# EAGLE schematic Nextronic-Arduino (EAGLE 7.5.0)
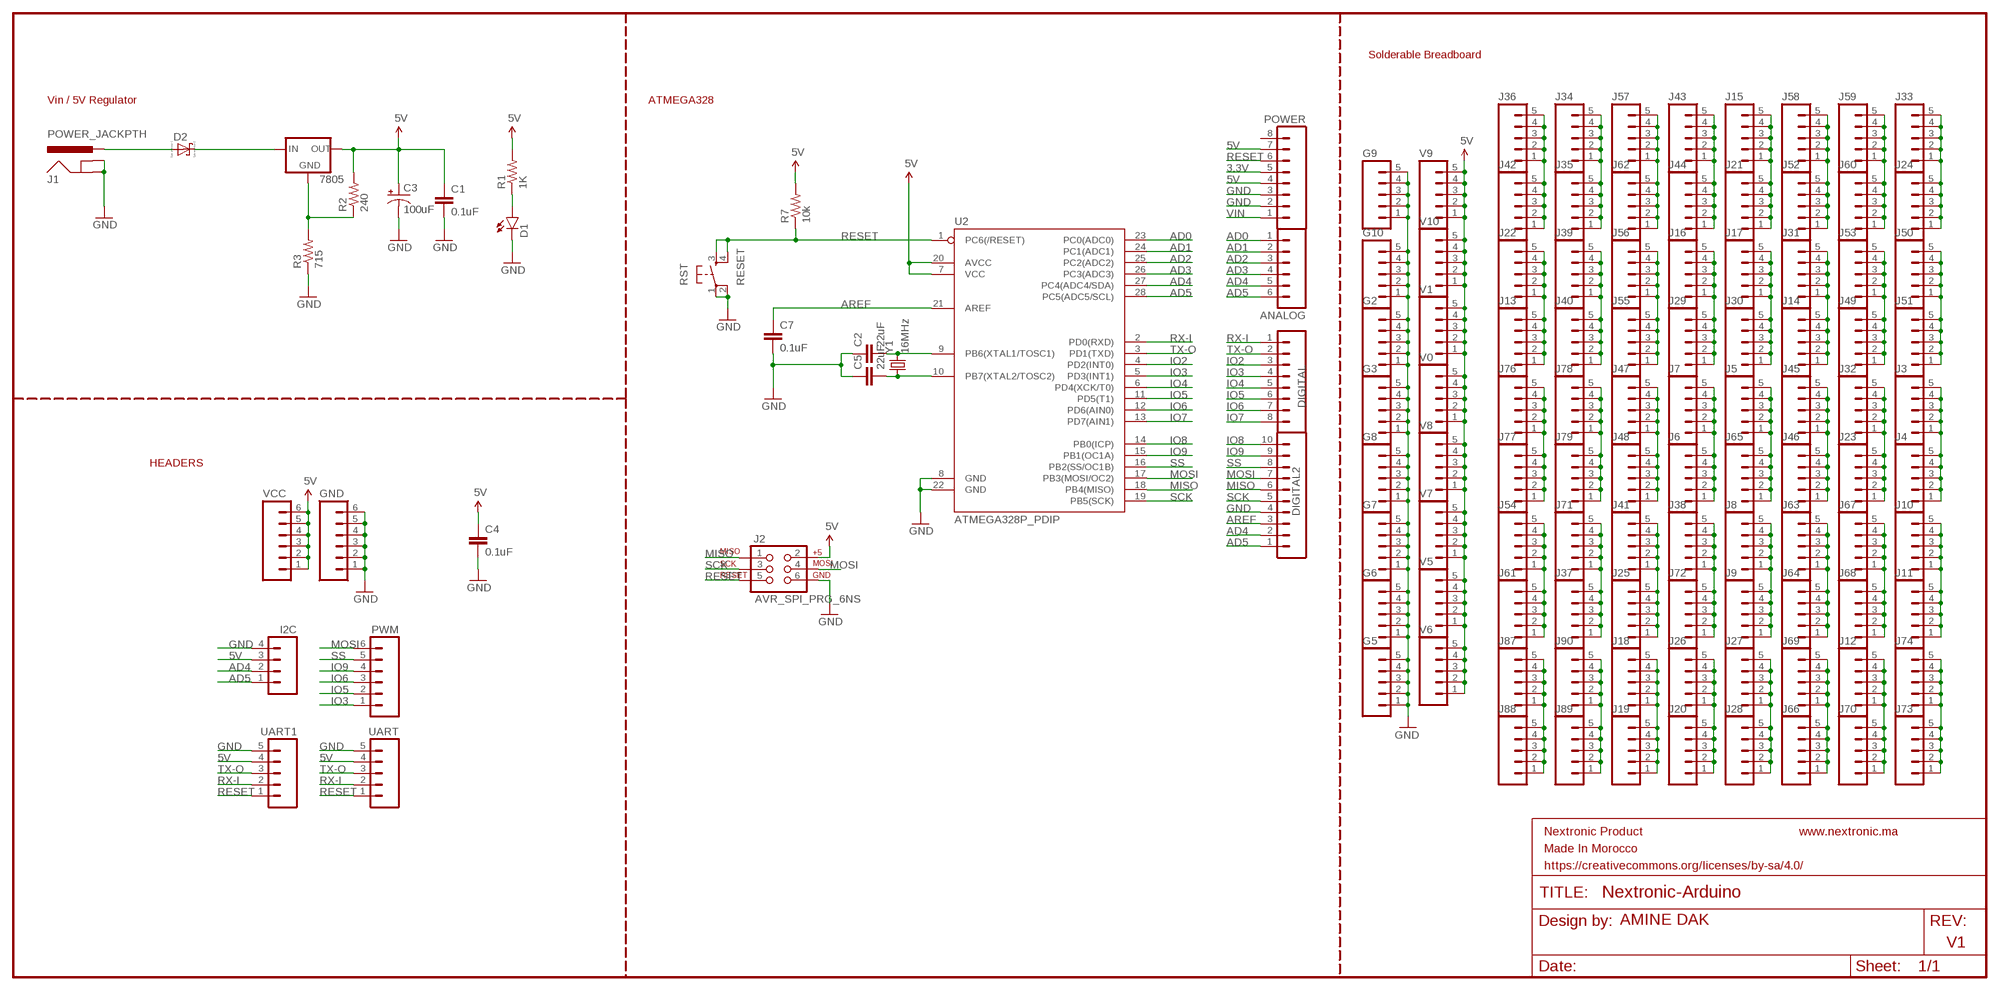
[diagram p0: schematic, sheet 1]

## Parts
7805  V_REG_78XX-TO-220  [TO-220-ALT]
ANALOG  M06SILK_FEMALE_PTH  [1X06]
C1  0.1uF  CAPEZ  [CAP-PTH-SMALLEZ]
C2  22uF  CAPEZ  [CAP-PTH-SMALLEZ]
C3  100uF  CAP_POLPTH1  [CPOL-RADIAL-100UF-25V]
C4  0.1uF  CAPEZ  [CAP-PTH-SMALLEZ]
C5  22uF  CAPEZ  [CAP-PTH-SMALLEZ]
C7  0.1uF  CAPEZ  [CAP-PTH-SMALLEZ]
D1  LED-3MM-NO_SILK  [LED3MM-NS]
D2  SCHOTTKY-DIODEDO35-7  [DIODE_DO35-7]
DIGITAL  M08SILK_FEMALE_PTH  [1X08]
DIGITAL2  M10SILK_FEMALE_PTH  [1X10]
G2  M05PTH  [1X05]
G3  M05PTH  [1X05]
G5  M05PTH  [1X05]
G6  M05PTH  [1X05]
G7  M05PTH  [1X05]
G8  M05PTH  [1X05]
G9  M05PTH  [1X05]
G10  M05PTH  [1X05]
GND  M06SILK_FEMALE_PTH  [1X06]
I2C  M04PTH  [1X04]
J1  POWER_JACKPTH  [POWER_JACK_PTH]
J2  AVR_SPI_PRG_6NS  [2X3-NS]
J3  M05PTH  [1X05]
J4  M05PTH  [1X05]
J5  M05PTH  [1X05]
J6  M05PTH  [1X05]
J7  M05PTH  [1X05]
J8  M05PTH  [1X05]
J9  M05PTH  [1X05]
J10  M05PTH  [1X05]
J11  M05PTH  [1X05]
J12  M05PTH  [1X05]
J13  M05PTH  [1X05]
J14  M05PTH  [1X05]
J15  M05PTH  [1X05]
J16  M05PTH  [1X05]
J17  M05PTH  [1X05]
J18  M05PTH  [1X05]
J19  M05PTH  [1X05]
J20  M05PTH  [1X05]
J21  M05PTH  [1X05]
J22  M05PTH  [1X05]
J23  M05PTH  [1X05]
J24  M05PTH  [1X05]
J25  M05PTH  [1X05]
J26  M05PTH  [1X05]
J27  M05PTH  [1X05]
J28  M05PTH  [1X05]
J29  M05PTH  [1X05]
J30  M05PTH  [1X05]
J31  M05PTH  [1X05]
J32  M05PTH  [1X05]
J33  M05PTH  [1X05]
J34  M05PTH  [1X05]
J35  M05PTH  [1X05]
J36  M05PTH  [1X05]
J37  M05PTH  [1X05]
J38  M05PTH  [1X05]
J39  M05PTH  [1X05]
J40  M05PTH  [1X05]
J41  M05PTH  [1X05]
J42  M05PTH  [1X05]
J43  M05PTH  [1X05]
J44  M05PTH  [1X05]
J45  M05PTH  [1X05]
J46  M05PTH  [1X05]
J47  M05PTH  [1X05]
J48  M05PTH  [1X05]
J49  M05PTH  [1X05]
J50  M05PTH  [1X05]
J51  M05PTH  [1X05]
J52  M05PTH  [1X05]
J53  M05PTH  [1X05]
J54  M05PTH  [1X05]
J55  M05PTH  [1X05]
J56  M05PTH  [1X05]
J57  M05PTH  [1X05]
J58  M05PTH  [1X05]
J59  M05PTH  [1X05]
J60  M05PTH  [1X05]
J61  M05PTH  [1X05]
J62  M05PTH  [1X05]
J63  M05PTH  [1X05]
J64  M05PTH  [1X05]
J65  M05PTH  [1X05]
J66  M05PTH  [1X05]
J67  M05PTH  [1X05]
J68  M05PTH  [1X05]
J69  M05PTH  [1X05]
J70  M05PTH  [1X05]
J71  M05PTH  [1X05]
J72  M05PTH  [1X05]
J73  M05PTH  [1X05]
J74  M05PTH  [1X05]
J76  M05PTH  [1X05]
J77  M05PTH  [1X05]
J78  M05PTH  [1X05]
J79  M05PTH  [1X05]
J87  M05PTH  [1X05]
J88  M05PTH  [1X05]
J89  M05PTH  [1X05]
J90  M05PTH  [1X05]
POWER  M08SILK_FEMALE_PTH  [1X08]
PWM  M06SILK_FEMALE_PTH  [1X06]
R1  1K  RESISTORAXIAL-0.3  [AXIAL-0.3]
R2  240  RESISTORAXIAL-0.3  [AXIAL-0.3]
R3  715  RESISTORAXIAL-0.3  [AXIAL-0.3]
R7  10k  RESISTORAXIAL-0.3  [AXIAL-0.3]
RST  RESET  TAC_SWITCHPTH  [TACTILE-PTH]
U2  ATMEGA328P_PDIP  [DIL28-3]
UART  M05PTH  [1X05]
UART1  M05PTH  [1X05]
V0  M05PTH  [1X05]
V1  M05PTH  [1X05]
V5  M05PTH  [1X05]
V6  M05PTH  [1X05]
V7  M05PTH  [1X05]
V8  M05PTH  [1X05]
V9  M05PTH  [1X05]
V10  M05PTH  [1X05]
VCC  M06SILK_FEMALE_PTH  [1X06]
Y1  16MHz  CRYSTALHC49US  [HC49US]

## Nets
3.3V: POWER.5
5V: 7805.OUT C1.1 C3.1(+) C4.1 I2C.3 J2.2 POWER.4 POWER.7 R1.P$2 R2.P$2 R7.P$2 U2.7(VCC) U2.20(AVCC) UART1.4 UART.4 V0.1 V0.2 V0.3 V0.4 V0.5 V1.1 V1.2 V1.3 V1.4 V1.5 V5.1 V5.2 V5.3 V5.4 V5.5 V6.1 V6.2 V6.3 V6.4 V6.5 V7.1 V7.2 V7.3 V7.4 V7.5 V8.1 V8.2 V8.3 V8.4 V8.5 V9.1 V9.2 V9.3 V9.4 V9.5 V10.1 V10.2 V10.3 V10.4 V10.5 VCC.1 VCC.2 VCC.3 VCC.4 VCC.5 VCC.6
AD0: ANALOG.1 U2.23(PC0(ADC0))
AD1: ANALOG.2 U2.24(PC1(ADC1))
AD2: ANALOG.3 U2.25(PC2(ADC2))
AD3: ANALOG.4 U2.26(PC3(ADC3))
AD4: ANALOG.5 DIGITAL2.2 I2C.2 U2.27(PC4(ADC4/SDA))
AD5: ANALOG.6 DIGITAL2.1 I2C.1 U2.28(PC5(ADC5/SCL))
AREF: C7.1 DIGITAL2.3 U2.21(AREF)
GND: C1.2 C2.1 C3.2(-) C4.2 C5.1 C7.2 D1.K(C) DIGITAL2.4 G2.1 G2.2 G2.3 G2.4 G2.5 G3.1 G3.2 G3.3 G3.4 G3.5 G5.1 G5.2 G5.3 G5.4 G5.5 G6.1 G6.2 G6.3 G6.4 G6.5 G7.1 G7.2 G7.3 G7.4 G7.5 G8.1 G8.2 G8.3 G8.4 G8.5 G9.1 G9.2 G9.3 G9.4 G9.5 G10.1 G10.2 G10.3 G10.4 G10.5 GND.1 GND.2 GND.3 GND.4 GND.5 GND.6 I2C.4 J1.GND J1.GNDBREAK J2.6 POWER.2 POWER.3 R3.P$1 RST.1 RST.2 U2.8(GND) U2.22(GND) UART1.5 UART.5
IO2: DIGITAL.3 U2.4(PD2(INT0))
IO3: DIGITAL.4 PWM.1 U2.5(PD3(INT1))
IO4: DIGITAL.5 U2.6(PD4(XCK/T0))
IO5: DIGITAL.6 PWM.2 U2.11(PD5(T1))
IO6: DIGITAL.7 PWM.3 U2.12(PD6(AIN0))
IO7: DIGITAL.8 U2.13(PD7(AIN1))
IO8: DIGITAL2.10 U2.14(PB0(ICP))
IO9: DIGITAL2.9 PWM.4 U2.15(PB1(OC1A))
MISO: DIGITAL2.6 J2.1 U2.18(PB4(MISO))
MOSI: DIGITAL2.7 J2.4 PWM.6 U2.17(PB3(MOSI/OC2))
N$1: 7805.GND R2.P$1 R3.P$2
N$2: J18.1 J18.2 J18.3 J18.4 J18.5 J19.1 J19.2 J19.3 J19.4 J19.5
N$3: J87.1 J87.2 J87.3 J87.4 J87.5 J88.1 J88.2 J88.3 J88.4 J88.5
N$4: D1.A R1.P$1
N$5: J89.1 J89.2 J89.3 J89.4 J89.5 J90.1 J90.2 J90.3 J90.4 J90.5
N$6: J37.1 J37.2 J37.3 J37.4 J37.5 J71.1 J71.2 J71.3 J71.4 J71.5
N$7: C2.2 U2.9(PB6(XTAL1/TOSC1)) Y1.2
N$8: C5.2 U2.10(PB7(XTAL2/TOSC2)) Y1.1
N$9: J3.1 J3.2 J3.3 J3.4 J3.5 J4.1 J4.2 J4.3 J4.4 J4.5
N$10: J20.1 J20.2 J20.3 J20.4 J20.5 J26.1 J26.2 J26.3 J26.4 J26.5
N$11: J10.1 J10.2 J10.3 J10.4 J10.5 J11.1 J11.2 J11.3 J11.4 J11.5
N$12: J76.1 J76.2 J76.3 J76.4 J76.5 J77.1 J77.2 J77.3 J77.4 J77.5
N$13: J27.1 J27.2 J27.3 J27.4 J27.5 J28.1 J28.2 J28.3 J28.4 J28.5
N$14: J25.1 J25.2 J25.3 J25.4 J25.5 J41.1 J41.2 J41.3 J41.4 J41.5
N$15: J78.1 J78.2 J78.3 J78.4 J78.5 J79.1 J79.2 J79.3 J79.4 J79.5
N$16: J66.1 J66.2 J66.3 J66.4 J66.5 J69.1 J69.2 J69.3 J69.4 J69.5
N$17: J45.1 J45.2 J45.3 J45.4 J45.5 J46.1 J46.2 J46.3 J46.4 J46.5
N$18: D2.A(C) J1.PWR
N$19: J47.1 J47.2 J47.3 J47.4 J47.5 J48.1 J48.2 J48.3 J48.4 J48.5
N$20: J12.1 J12.2 J12.3 J12.4 J12.5 J70.1 J70.2 J70.3 J70.4 J70.5
N$21: J73.1 J73.2 J73.3 J73.4 J73.5 J74.1 J74.2 J74.3 J74.4 J74.5
N$22: J54.1 J54.2 J54.3 J54.4 J54.5 J61.1 J61.2 J61.3 J61.4 J61.5
N$23: J38.1 J38.2 J38.3 J38.4 J38.5 J72.1 J72.2 J72.3 J72.4 J72.5
N$24: J24.1 J24.2 J24.3 J24.4 J24.5 J33.1 J33.2 J33.3 J33.4 J33.5
N$25: J23.1 J23.2 J23.3 J23.4 J23.5 J32.1 J32.2 J32.3 J32.4 J32.5
N$26: J67.1 J67.2 J67.3 J67.4 J67.5 J68.1 J68.2 J68.3 J68.4 J68.5
N$27: J49.1 J49.2 J49.3 J49.4 J49.5 J53.1 J53.2 J53.3 J53.4 J53.5
N$28: J59.1 J59.2 J59.3 J59.4 J59.5 J60.1 J60.2 J60.3 J60.4 J60.5
N$29: J14.1 J14.2 J14.3 J14.4 J14.5 J31.1 J31.2 J31.3 J31.4 J31.5
N$30: J17.1 J17.2 J17.3 J17.4 J17.5 J30.1 J30.2 J30.3 J30.4 J30.5
N$31: J52.1 J52.2 J52.3 J52.4 J52.5 J58.1 J58.2 J58.3 J58.4 J58.5
N$32: J50.1 J50.2 J50.3 J50.4 J50.5 J51.1 J51.2 J51.3 J51.4 J51.5
N$33: J16.1 J16.2 J16.3 J16.4 J16.5 J29.1 J29.2 J29.3 J29.4 J29.5
N$34: J43.1 J43.2 J43.3 J43.4 J43.5 J44.1 J44.2 J44.3 J44.4 J44.5
N$35: J15.1 J15.2 J15.3 J15.4 J15.5 J21.1 J21.2 J21.3 J21.4 J21.5
N$36: J36.1 J36.2 J36.3 J36.4 J36.5 J42.1 J42.2 J42.3 J42.4 J42.5
N$37: J13.1 J13.2 J13.3 J13.4 J13.5 J22.1 J22.2 J22.3 J22.4 J22.5
N$38: J6.1 J6.2 J6.3 J6.4 J6.5 J7.1 J7.2 J7.3 J7.4 J7.5
N$39: J8.1 J8.2 J8.3 J8.4 J8.5 J9.1 J9.2 J9.3 J9.4 J9.5
N$40: J34.1 J34.2 J34.3 J34.4 J34.5 J35.1 J35.2 J35.3 J35.4 J35.5
N$41: J39.1 J39.2 J39.3 J39.4 J39.5 J40.1 J40.2 J40.3 J40.4 J40.5
N$42: J5.1 J5.2 J5.3 J5.4 J5.5 J65.1 J65.2 J65.3 J65.4 J65.5
N$43: J63.1 J63.2 J63.3 J63.4 J63.5 J64.1 J64.2 J64.3 J64.4 J64.5
N$44: J57.1 J57.2 J57.3 J57.4 J57.5 J62.1 J62.2 J62.3 J62.4 J62.5
N$45: J55.1 J55.2 J55.3 J55.4 J55.5 J56.1 J56.2 J56.3 J56.4 J56.5
N$46: 7805.IN D2.C(A)
RESET: J2.5 POWER.6 R7.P$1 RST.3 RST.4 U2.1(PC6(/RESET)) UART1.1 UART.1
RX-I: DIGITAL.1 U2.2(PD0(RXD)) UART1.2 UART.2
SCK: DIGITAL2.5 J2.3 U2.19(PB5(SCK))
SS: DIGITAL2.8 PWM.5 U2.16(PB2(SS/OC1B))
TX-O: DIGITAL.2 U2.3(PD1(TXD)) UART1.3 UART.3
VIN: POWER.1
Unconnected: POWER.8

## Notes on the sheet
- Solderable Breadboard
- Vin / 5V Regulator | ATMEGA328
- HEADERS
- Nextronic Product | www.nextronic.ma
- Made In Morocco
- https://creativecommons.org/licenses/by-sa/4.0/
- TITLE:
- Design by: | AMINE DAK | REV:
- V1
- Date: | Sheet:

## Library data of the parts
7805 = SparkFun-PowerIC:V_REG_78XX: Voltage Regulator Standard 78xx regulator. IGO (Input Ground Output). Spark Fun Electronics SKU : COM-00107; OC_FARNELL: unknown; PROD_ID: VREG-08450; SF_ID: COM-00107
ANALOG GND PWM VCC = SparkFun-Connectors:M06: Header 6 Standard 6-pin 0.1" header. Use with straight break away headers (SKU : PRT-00116), right angle break away headers (PRT-00553), swiss pins (PRT-00743), machine pins (PRT-00117), and female headers (PRT-00115). Molex polarized connector foot print use with SKU : PRT-08094 with associated crimp pins and housings. NOTES ON THE VARIANTS LOCK and LOCK_LONGPADS... This footprint was designed to help hold the alignment of a through-hole component (i.e. 6-pin header) while soldering it into place. You may notice that each hole has been shifted either up or down by 0.005 of an inch from it's more standard position (which is a perfectly straight line). This slight alteration caused the pins (the squares in the middle) to touch the edges of the holes. Because they are alternating, it causes a "brace" to hold the component in place. 0.005 has proven to be the perfect amount of "off-center" position when using our standard breakaway headers. Although looks a little odd when you look at the bare footprint, once you have a header in there, the alteration is very hard to notice. Also,if you push a header all the way into place, it is covered up entirely on the bottom side. This idea of altering the position of holes to aid alignment will be further integrated into the Sparkfun Library for other footprints. It can help hold any component with 3 or more connection pins.; OC_FARNELL: unknown; PROD_ID: CONN-08437
C1 C4 C7 = SparkFun-Capacitors:CAP: Capacitor Standard 0603 ceramic capacitor, and 0.1" leaded capacitor.; MF: MULTICOMP; MPN: MCRR25104X7RK0050; OC_FARNELL: 1216438
C2 C5 = SparkFun-Capacitors:CAP: Capacitor Standard 0603 ceramic capacitor, and 0.1" leaded capacitor.; MF: MULTICOMP; MPN: MCGPR100V226M8X11; OC_FARNELL: 9451579
C3 = SparkFun-Capacitors:CAP_POL: Capacitor Polarized These are standard SMD and PTH capacitors. Normally 10uF, 47uF, and 100uF in electrolytic and tantalum varieties. Always verify the external diameter of the through hole cap, it varies with capacity, voltage, and manufacturer. The EIA devices should be standard.; MF: MULTICOMP; MPN: MCGPR25V107M6.3X11; OC_FARNELL: 9451188
D1 = SparkFun-LED:LED: LEDs Standard schematic elements and footprints for 5mm, 3mm, 1206, and 0603 sized LEDs. 5mm - Spark Fun Electronics SKU : COM-00529 (and others); OC_FARNELL: unknown
D2 = eagle-ltspice:SCHOTTKY-DIODE: Schottky Diode; SPICEMODEL: NONE; SPICEPREFIX: D; SPICETYPE: diode
DIGITAL POWER = SparkFun-Connectors:M08: Header 8 Standard 8-pin 0.1" header. Use with straight break away headers (SKU : PRT-00116), right angle break away headers (PRT-00553), swiss pins (PRT-00743), machine pins (PRT-00117), and female headers (PRT-00115).; OC_FARNELL: unknown; PROD_ID: CONN-08438
DIGITAL2 = SparkFun-Connectors:M10: Header 10 Standard 10-pin 0.1" header. Use with straight break away headers (SKU : PRT-00116), right angle break away headers (PRT-00553), swiss pins (PRT-00743), machine pins (PRT-00117), and female headers (PRT-00115).; OC_FARNELL: unknown; PROD_ID: CONN-11563
G2 G3 G5-G10 J3-J74 J76-J79 J87-J90 UART UART1 V0 V1 V5-V10 = SparkFun-Connectors:M05: Header 5 Standard 5-pin 0.1" header. Use with straight break away headers (SKU : PRT-00116), right angle break away headers (PRT-00553), swiss pins (PRT-00743), machine pins (PRT-00117), and female headers (PRT-00115). Molex polarized connector foot print use with SKU : PRT-08230 with associated crimp pins and housings.; OC_FARNELL: unknown
I2C = SparkFun-Connectors:M04: Header 4 Standard 4-pin 0.1" header. Use with straight break away headers (SKU : PRT-00116), right angle break away headers (PRT-00553), swiss pins (PRT-00743), machine pins (PRT-00117), and female headers (PRT-00115). Molex polarized connector foot print use with SKU : PRT-08231 with associated crimp pins and housings. 1MM SMD Version SKU: PRT-10208; OC_FARNELL: unknown; PROD_ID: CONN-09696
J1 = SparkFun-Connectors:POWER_JACK: Power Jack This is the standard 5.5mm barrel jack for power. The PTH is the most common, proven, reliable, footprint. The Slot footprint only works if the mill layer is transmitted to the PCB fab house so be warned. Mating wall wart : TOL-00298 (and others); OC_FARNELL: unknown; PROD_ID: CONN-08197
J2 = SparkFun-Connectors:AVR_SPI_PRG_6: AVR ISP 6 Pin This is the reduced ISP connector for AVR programming. Common on Arduino. This footprint will take up less PCB space and can be used with a 10-pin to 6-pin adapter such as SKU: BOB-08508 **Special note about "TEST_POINT" package. The stop mask is on the top side, so if you want your programming test points to be on the bottom of your board, make sure to place this package on the bottom side of the board. This also ensure that the orientation to program from the bottom side will be correct.; OC_FARNELL: unknown
R1 = SparkFun-Resistors:RESISTOR: Resistor Basic schematic elements and footprints for 0603, 1206, and PTH resistors.; MF: MULTICOMP; MPN: MCRE000037; OC_FARNELL: 1700237
R2 = SparkFun-Resistors:RESISTOR: Resistor Basic schematic elements and footprints for 0603, 1206, and PTH resistors.; MF: WELWYN; MPN: MFR4-240RFI; OC_FARNELL: 1099876
R3 = SparkFun-Resistors:RESISTOR: Resistor Basic schematic elements and footprints for 0603, 1206, and PTH resistors.; MF: TE CONNECTIVITY / NEOHM; MPN: YR1B715RCC; OC_FARNELL: 1083234
R7 = SparkFun-Resistors:RESISTOR: Resistor Basic schematic elements and footprints for 0603, 1206, and PTH resistors.; OC_FARNELL: unknown
RST = SparkFun-Retired:TAC_SWITCH: Momentary Switch Button commonly used for reset or general input. Spark Fun Electronics SKU : COM-00097 SMT- SWCH-08247; OC_FARNELL: unknown
U2 = SparkFun-DigitalIC:ATMEGA328P_PDIP: uC used in the Arduino 32kb flash, 1k EEPROM, 2k SRAM This is the through-hole version of this chip.; MF: ATMEL; MPN: ATMEGA328-PU; OC_FARNELL: 1972087
Y1 = SparkFun-FreqCtrl:CRYSTAL: Various standard crystals. Proven footprints.; MF: RALTRON; MPN: AS-16.000-18; OC_FARNELL: 1611761

## Net classes
0 default: width 0.152 mm, drill 0.305 mm, clearance 0.152 mm